# EAGLE design RapideUSB (EAGLE 6.3)
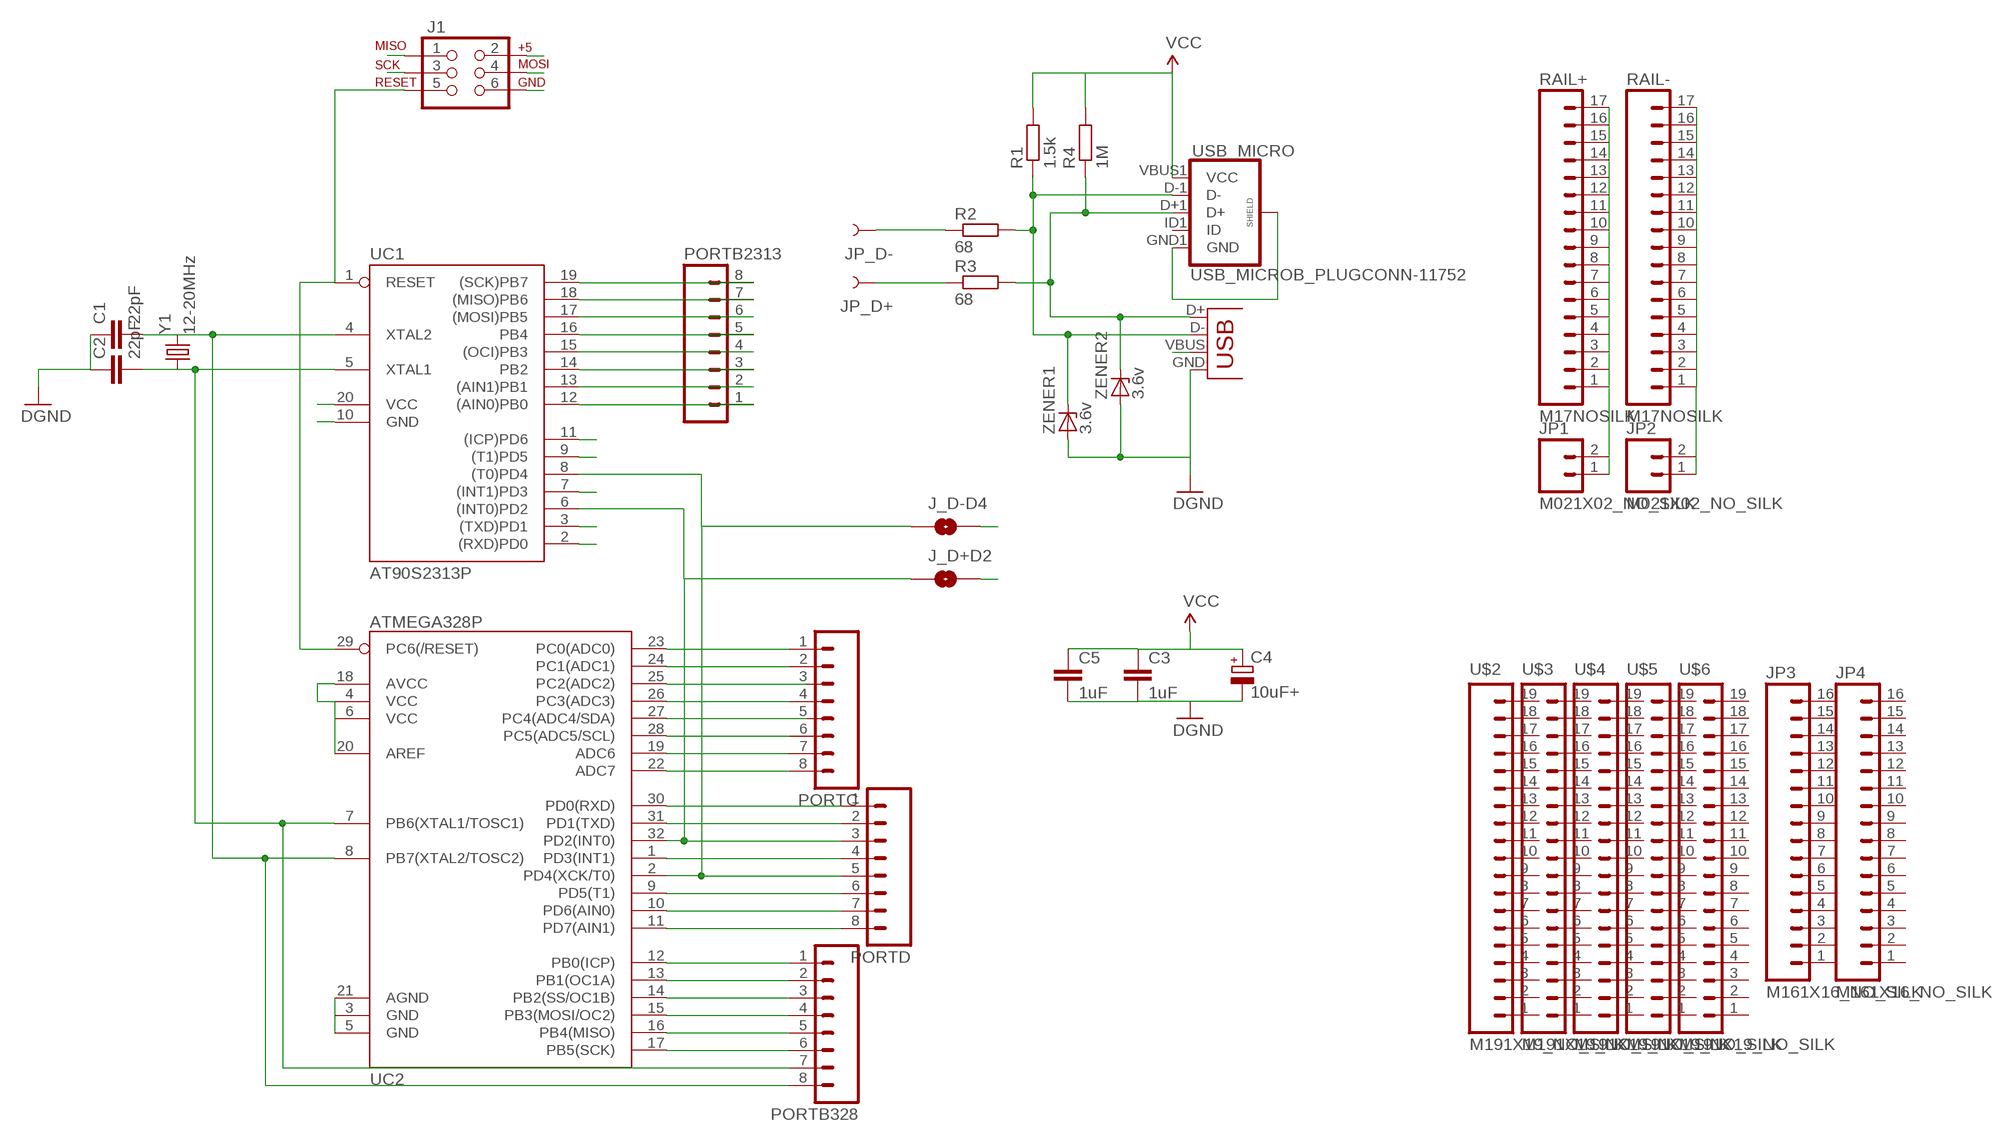
[diagram p0: schematic, sheet 1]

## Parts
C1  22pF  C-EU025-024X044  [C025-024X044]
C2  22pF  C-EU025-024X044  [C025-024X044]
C3  1uF  C-EU025-024X044  [C025-024X044]
C4  10uF+  CPOL-EUE2-5  [E2-5]
C5  1uF  C-EU025-024X044  [C025-024X044]
J1  AVR_SPI_PRG_6PTH  [2X3]
J_D+D2  JUMPER-PAD-2-NOYES_SILK  [PAD-JUMPER-2-NO_YES_SILK]
J_D-D4  JUMPER-PAD-2-NOYES_SILK  [PAD-JUMPER-2-NO_YES_SILK]
JP1  M021X02_NO_SILK  [1X02_NO_SILK]
JP2  M021X02_NO_SILK  [1X02_NO_SILK]
JP3  M161X16_NO_SILK  [1X16_NO_SILK]
JP4  M161X16_NO_SILK  [1X16_NO_SILK]
JP_D+  TEST-POINT3X5  [PAD.03X.05]
JP_D-  TEST-POINT3X5  [PAD.03X.05]
PORTB328  M081X08  [1X08]
PORTB2313  M081X08  [1X08]
PORTC  M081X08  [1X08]
PORTD  M081X08  [1X08]
R1  1.5k  R-EU_0204/2V  [0204V]
R2  68  R-EU_0204/2V  [0204V]
R3  68  R-EU_0204/2V  [0204V]
R4  1M  R-EU_0204/2V  [0204V]
RAIL+  M17NOSILK  [1X17_NO_SILK]
RAIL-  M17NOSILK  [1X17_NO_SILK]
U$2  M191X19_NO_SILK  [1X19_NO_SILK]
U$3  M191X19_NO_SILK  [1X19_NO_SILK]
U$4  M191X19_NO_SILK  [1X19_NO_SILK]
U$5  M191X19_NO_SILK  [1X19_NO_SILK]
U$6  M191X19_NO_SILK  [1X19_NO_SILK]
UC1  AT90S2313P  [DIL20]
UC2  ATMEGA328P  ATMEGA328_SMT  [TQFP32-08]
USB_MICRO  USB_MICROB_PLUGCONN-11752  [USB-B-MICRO-SMD_V03]
USB_MINI  USBSMD  [USB-MINIB]
Y1  12-20MHz  CRYSTALHC49UV  [HC49U-V]
ZENER1  3.6v  ZENER-DIODEZD-2.5  [ZDIO-2.5]
ZENER2  3.6v  ZENER-DIODEZD-2.5  [ZDIO-2.5]

## Nets
B0: PORTB328.1 UC2.12(PB0(ICP))
B1: PORTB328.2 UC2.13(PB1(OC1A))
B2: PORTB328.3 UC2.14(PB2(SS/OC1B))
B6: C2.2 PORTB328.7 UC1.5(XTAL1) UC2.7(PB6(XTAL1/TOSC1)) Y1.1
B7: C1.2 PORTB328.8 UC1.4(XTAL2) UC2.8(PB7(XTAL2/TOSC2)) Y1.2
D0: PORTD.1 UC1.2((RXD)PD0) UC2.30(PD0(RXD))
D1: PORTD.2 UC1.3((TXD)PD1) UC2.31(PD1(TXD))
D2: J_D+D2.1 PORTD.3 UC1.6((INT0)PD2) UC2.32(PD2(INT0))
D3: PORTD.4 UC1.7((INT1)PD3) UC2.1(PD3(INT1))
D4: J_D-D4.1 PORTD.5 UC1.8((T0)PD4) UC2.2(PD4(XCK/T0))
D5: UC1.9((T1)PD5)
D6: PORTD.7 UC1.11((ICP)PD6) UC2.10(PD6(AIN0))
D7: PORTD.8 UC2.11(PD7(AIN1))
D+: J_D+D2.2 JP_D+.P$1 R3.1
D-: J_D-D4.2 JP_D-.P$1 R2.1
GND: C1.1 C2.1 C3.2 C4.- C5.2 J1.6 JP2.1 JP2.2 RAIL-.1 RAIL-.2 RAIL-.3 RAIL-.4 RAIL-.5 RAIL-.6 RAIL-.7 RAIL-.8 RAIL-.9 RAIL-.10 RAIL-.11 RAIL-.12 RAIL-.13 RAIL-.14 RAIL-.15 RAIL-.16 RAIL-.17 UC1.10(GND) UC2.3(GND) UC2.5(GND) UC2.21(AGND) USB_MICRO.GND1(GND) USB_MICRO.SHIELD1(SHIELD) USB_MICRO.SHIELD2(SHIELD) USB_MICRO.SHIELD3(SHIELD) USB_MINI.GND ZENER1.A ZENER2.A ; supply symbol labelled DGND
MISO: J1.1 PORTB328.5 PORTB2313.7 UC1.18((MISO)PB6) UC2.16(PB4(MISO))
MOSI: J1.4 PORTB328.4 PORTB2313.6 UC1.17((MOSI)PB5) UC2.15(PB3(MOSI/OC2))
N$1: PORTB2313.5 UC1.16(PB4)
N$2: PORTB2313.4 UC1.15((OCI)PB3)
N$3: PORTB2313.3 UC1.14(PB2)
N$4: PORTB2313.2 UC1.13((AIN1)PB1)
N$5: PORTC.1 UC2.23(PC0(ADC0))
N$6: PORTC.2 UC2.24(PC1(ADC1))
N$7: UC2.25(PC2(ADC2))
N$8: PORTC.4 UC2.26(PC3(ADC3))
N$9: PORTC.5 UC2.27(PC4(ADC4/SDA))
N$10: PORTC.6 UC2.28(PC5(ADC5/SCL))
N$11: PORTC.7 UC2.19(ADC6)
N$12: PORTC.8 UC2.22(ADC7)
N$13: PORTB2313.1 UC1.12((AIN0)PB0)
N$16: PORTD.6 UC2.9(PD5(T1))
RESET: J1.5 UC1.1(RESET) UC2.29(PC6(/RESET))
SCK: J1.3 PORTB328.6 PORTB2313.8 UC1.19((SCK)PB7) UC2.17(PB5(SCK))
USBD+: R3.2 R4.1 USB_MICRO.D+1(D+) USB_MINI.D+ ZENER2.C
USBD-: R1.1 R2.2 USB_MICRO.D-1(D-) USB_MINI.D- ZENER1.C
VCC: C3.1 C4.+ C5.1 J1.2 JP1.1 JP1.2 R1.2 R4.2 RAIL+.1 RAIL+.2 RAIL+.3 RAIL+.4 RAIL+.5 RAIL+.6 RAIL+.7 RAIL+.8 RAIL+.9 RAIL+.10 RAIL+.11 RAIL+.12 RAIL+.13 RAIL+.14 RAIL+.15 RAIL+.16 RAIL+.17 UC1.20(VCC) UC2.4(VCC) UC2.6(VCC) UC2.18(AVCC) UC2.20(AREF) USB_MICRO.VBUS1(VCC) USB_MINI.VBUS
Unconnected: JP3.1 JP3.2 JP3.3 JP3.4 JP3.5 JP3.6 JP3.7 JP3.8 JP3.9 JP3.10 JP3.11 JP3.12 JP3.13 JP3.14 JP3.15 JP3.16 JP4.1 JP4.2 JP4.3 JP4.4 JP4.5 JP4.6 JP4.7 JP4.8 JP4.9 JP4.10 JP4.11 JP4.12 JP4.13 JP4.14 JP4.15 JP4.16 PORTC.3 U$2.1 U$2.2 U$2.3 U$2.4 U$2.5 U$2.6 U$2.7 U$2.8 U$2.9 U$2.10 U$2.11 U$2.12 U$2.13 U$2.14 U$2.15 U$2.16 U$2.17 U$2.18 U$2.19 U$3.1 U$3.2 U$3.3 U$3.4 U$3.5 U$3.6 U$3.7 U$3.8 U$3.9 U$3.10 U$3.11 U$3.12 U$3.13 U$3.14 U$3.15 U$3.16 U$3.17 U$3.18 U$3.19 U$4.1 U$4.2 U$4.3 U$4.4 U$4.5 U$4.6 U$4.7 U$4.8 U$4.9 U$4.10 U$4.11 U$4.12 U$4.13 U$4.14 U$4.15 U$4.16 U$4.17 U$4.18 U$4.19 U$5.1 U$5.2 U$5.3 U$5.4 U$5.5 U$5.6 U$5.7 U$5.8 U$5.9 U$5.10 U$5.11 U$5.12 U$5.13 U$5.14 U$5.15 U$5.16 U$5.17 U$5.18 U$5.19 U$6.1 U$6.2 U$6.3 U$6.4 U$6.5 U$6.6 U$6.7 U$6.8 U$6.9 U$6.10 U$6.11 U$6.12 U$6.13 U$6.14 U$6.15 U$6.16 U$6.17 U$6.18 U$6.19 USB_MICRO.ID1(ID)

## Library data of the parts
C1-C3 C5 = resistor:C-EU: CAPACITOR, European symbol
C4 = resistor:CPOL-EU: POLARIZED CAPACITOR, European symbol
J1 = SparkFun-Connectors:AVR_SPI_PRG_6: AVR ISP 6 Pin This is the reduced ISP connector for AVR programming. Common on Arduino. This footprint will take up less PCB space and can be used with a 10-pin to 6-pin adapter such as SKU: BOB-08508 **Special note about "TEST_POINT" package. The stop mask is on the top side, so if you want your programming test points to be on the bottom of your board, make sure to place this package on the bottom side of the board. This also ensure that the orientation to program from the bottom side will be correct.
J_D+D2 J_D-D4 = SparkFun-Passives:JUMPER-PAD-2-NO
JP1 JP2 = SparkFun-Connectors:M02: Standard 2-pin 0.1" header. Use with - straight break away headers ( PRT-00116) - right angle break away headers (PRT-00553) - swiss pins (PRT-00743) - machine pins (PRT-00117) - female headers (PRT-00115) Molex polarized connector foot print use with: PRT-08233 with associated crimp pins and housings. 2.54_SCREWTERM for use with PRT-10571. 3.5mm Screw Terminal footprints for PRT-08084 5mm Screw Terminal footprints for use with PRT-08433
JP3 JP4 = SparkFun-Connectors:M16: 1x16 .1" header
JP_D+ JP_D- = SparkFun-Passives:TEST-POINT: Bare copper test points for troubleshooting or ICT
PORTB328 PORTB2313 PORTC PORTD = SparkFun-Connectors:M08: Header 8 Standard 8-pin 0.1" header. Use with straight break away headers (SKU : PRT-00116), right angle break away headers (PRT-00553), swiss pins (PRT-00743), machine pins (PRT-00117), and female headers (PRT-00115).
R1-R4 = resistor:R-EU_: RESISTOR, European symbol
RAIL+ RAIL- = SparkFun-Connectors:M17: 1x17 .1" header
U$2-U$6 = SparkFun-Connectors:M19: 1x19 .1" header
UC1 = atmel:AT90S2313: MICROCONTROLLER 2 Kbytes FLASH 128 bytes SRAM 128 bytes EEPROM UART; OC_FARNELL: unknown; OC_NEWARK: unknown
UC2 = SparkFun-DigitalIC:ATMEGA328_SMT: 32-Pin Atmega328 part Commonly used on Arduino compatible boards Available in QFP and QFN packages TQFP is IC-09069 QFN is non-stock; PROD_ID: IC-09069
USB_MICRO = SparkFun-Connectors:USB_MICROB_PLUG: USB Micro-B connectors Some male, some female. Watch your step!; PROD_ID: CONN-11752
USB_MINI = SparkFun-Connectors:USB: USB Connectors USB-B-PTH is fully proven SKU : PRT-00139/CONN-08278 USB-miniB is fully proven SKU : PRT-00587 USB-A-PCB is untested. USB-A-H is throughly reviewed, but untested. Spark Fun Electronics SKU : PRT-00437 USB-B-SMT is throughly reviewed, but untested. Needs silkscreen touching up. USB-A-S has not been used/tested USB-MB-H has not been used/tested USB-MICROB has been used. CONN-09505; PROD_ID: CONN-08193
Y1 = SparkFun-FreqCtrl:CRYSTAL: Various standard crystals. Proven footprints.
ZENER1 ZENER2 = diode:ZENER-DIODE: Z-Diode

## Board
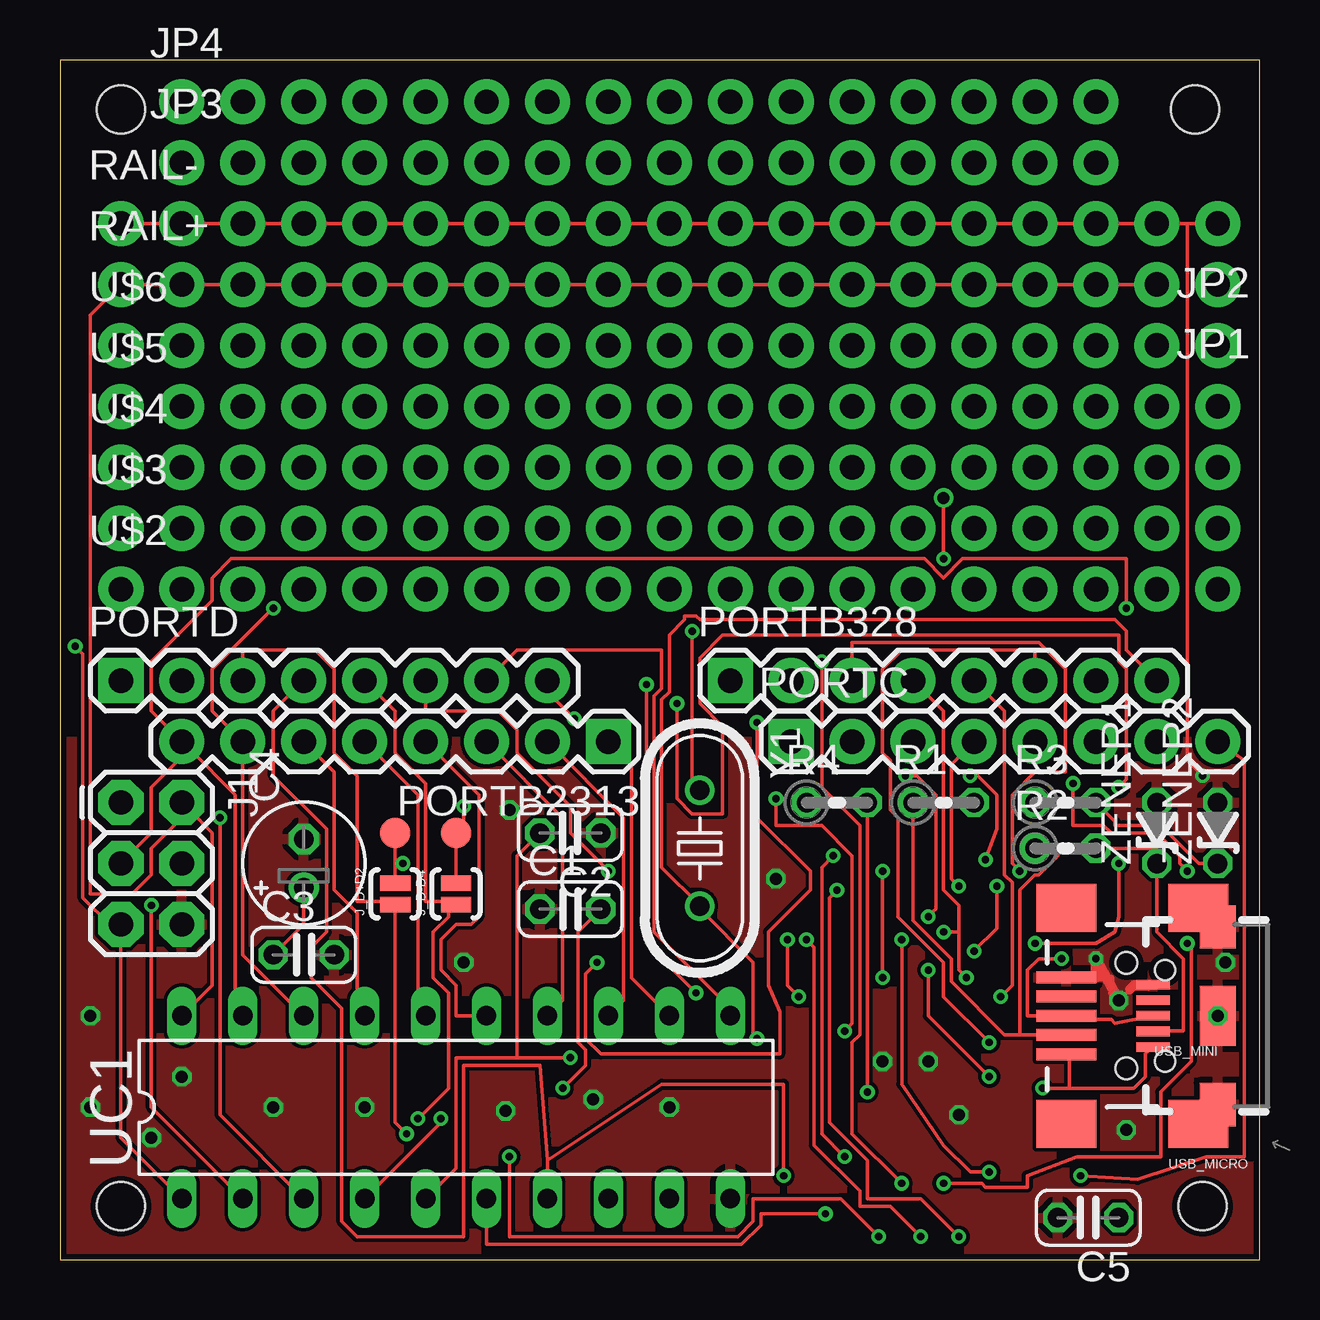
[diagram p1: board, top side]
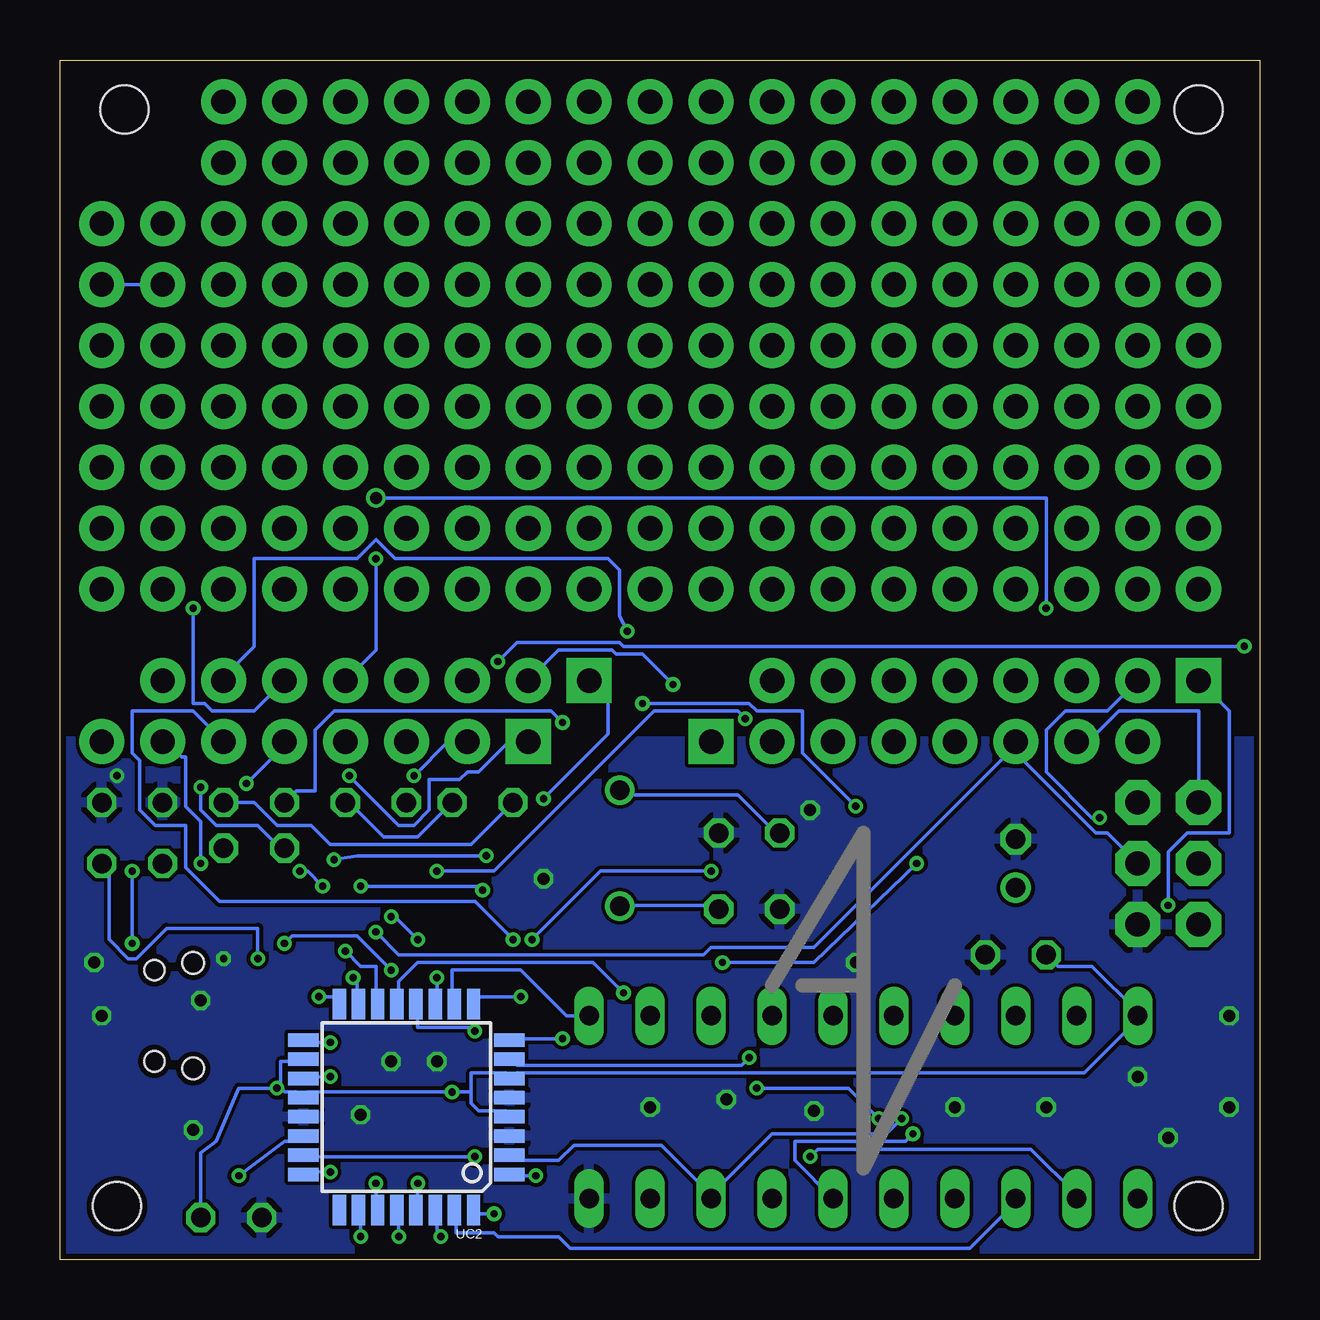
[diagram p2: board, bottom side, seen from below]

Size 50 x 50 mm. Coordinates in mm from the lower left corner, seen from the top.
Outline: 0,0 50,0 50,50 0,50 0,0
Copper layers (1*2*15*16): Top 0.035mm / dielectric 0.2mm / layer 2 0.0175mm / dielectric 1.1mm / layer 15 0.0175mm / dielectric 0.2mm / Bottom 0.035mm
Design rules "SeeedStudio_DRU_no_angle_20130527": minimum track width 6mil, minimum drill 12mil, track to track 6mil, track to pad 6mil, pad to pad 6mil, via to via 6mil, smd to smd 0mil, copper to edge 10mil, drill to drill 10mil, minimum pad ring 6mil, minimum via ring 6mil, stop-mask expansion 2mil, vias tented up to drill 25mil, thermal gap 10mil
Holes 2 mm at 47.62,2.22 2.54,47.94 47.31,47.94 2.54,2.22

### Footprints (pad centres in the part's own frame; a part is rotated, then mirrored left to right if it is on the bottom)
C025-024X044 = drill 0.813 octagon: 1 -1.27,0; 2 1.27,0
E2-5 = drill 0.813 pad 1.27: + -1.016,0 | drill 0.813 pad 1.27 octagon: - 1.016,0
2X3 = drill 1.016 pad 1.88 octagon: 1 0,0; 2 0,2.54; 3 2.54,0; 4 2.54,2.54; 5 5.08,0; 6 5.08,2.54
PAD-JUMPER-2-NO_YES_SILK = smd 0.635 x 1.27: 1 -0.45,0; 2 0.45,0
1X02_NO_SILK = drill 1.016 pad 1.88: 1 0,0; 2 2.54,0
1X16_NO_SILK = drill 1.016 pad 1.88: 1 0,0; 2 2.54,0; 3 5.08,0; 4 7.62,0; 5 10.16,0; 6 12.7,0; 7 15.24,0; 8 17.78,0; 9 20.32,0; 10 22.86,0; 11 25.4,0; 12 27.94,0; 13 30.48,0; 14 33.02,0; 15 35.56,0; 16 38.1,0
PAD.03X.05 = smd 1.27 x 1.27: P$1 0,0
1X08 = drill 1.016 pad 1.88 square: 1 0,0 | drill 1.016 pad 1.88: 2 2.54,0; 3 5.08,0; 4 7.62,0; 5 10.16,0; 6 12.7,0; 7 15.24,0; 8 17.78,0
0204V = drill 0.813 octagon: 1 -1.27,0; 2 1.27,0
1X17_NO_SILK = drill 1.016 pad 1.88: 1 0,0; 2 2.54,0; 3 5.08,0; 4 7.62,0; 5 10.16,0; 6 12.7,0; 7 15.24,0; 8 17.78,0; 9 20.32,0; 10 22.86,0; 11 25.4,0; 12 27.94,0; 13 30.48,0; 14 33.02,0; 15 35.56,0; 16 38.1,0; 17 40.64,0
1X19_NO_SILK = drill 1.016 pad 1.88: 1 0,0; 2 2.54,0; 3 5.08,0; 4 7.62,0; 5 10.16,0; 6 12.7,0; 7 15.24,0; 8 17.78,0; 9 20.32,0; 10 22.86,0; 11 25.4,0; 12 27.94,0; 13 30.48,0; 14 33.02,0; 15 35.56,0; 16 38.1,0; 17 40.64,0; 18 43.18,0; 19 45.72,0
DIL20 = drill 0.813 long: 1 -11.43,-3.81; 2 -8.89,-3.81; 3 -6.35,-3.81; 4 -3.81,-3.81; 5 -1.27,-3.81; 6 1.27,-3.81; 7 3.81,-3.81; 8 6.35,-3.81; 9 8.89,-3.81; 10 11.43,-3.81; 11 11.43,3.81; 12 8.89,3.81; 13 6.35,3.81; 14 3.81,3.81; 15 1.27,3.81; 16 -1.27,3.81; 17 -3.81,3.81; 18 -6.35,3.81; 19 -8.89,3.81; 20 -11.43,3.81
TQFP32-08 = smd 1.27 x 0.559: 1 -4.293,2.8; 2 -4.293,2; 3 -4.293,1.2; 4 -4.293,0.4; 5 -4.293,-0.4; 6 -4.293,-1.2; 7 -4.293,-2; 8 -4.293,-2.8; 17 4.293,-2.8; 18 4.293,-2; 19 4.293,-1.2; 20 4.293,-0.4; 21 4.293,0.4; 22 4.293,1.2; 23 4.293,2; 24 4.293,2.8 | smd 0.559 x 1.27: 9 -2.8,-4.293; 10 -2,-4.293; 11 -1.2,-4.293; 12 -0.4,-4.293; 13 0.4,-4.293; 14 1.2,-4.293; 15 2,-4.293; 16 2.8,-4.293; 25 2.8,4.293; 26 2,4.293; 27 1.2,4.293; 28 0.4,4.293; 29 -0.4,4.293; 30 -1.2,4.293; 31 -2,4.293; 32 -2.8,4.293
USB-B-MICRO-SMD_V03 = smd 1.4 x 0.4: D+1 2.7,0; D-1 2.7,0.65; GND1 2.7,-1.3; ID1 2.7,-0.65; VBUS1 2.7,1.3 | smd 1.5 x 1.8: SHIELD1 0,3.7; SHIELD2 0,-3.7 | smd 1.5 x 2.5: SHIELD3 0,0 | hole 0.85: 2.2,1.9; 2.2,-1.9
USB-MINIB = smd 2.5 x 0.5: D+ 2.5,0; D- 2.5,0.8; GND 2.5,-1.6; ID 2.5,-0.8; VBUS 2.5,1.6 | smd 2.5 x 2: MTN1 -3,4.5; MTN2 2.5,4.5; MTN3 -3,-4.5; MTN4 2.5,-4.5 | hole 0.9: 0,2.2; 0,-2.2
HC49U-V = drill 0.813: 1 -2.413,0; 2 2.413,0
ZDIO-2.5 = drill 0.813 octagon: A 1.27,0; C -1.27,0

### Placement (x,y rotation side)
C1  21.27,14.61 0 top
C2  21.27,17.78 180 top
C3  10.16,12.7 0 top
C4  10.16,16.51 90 top
C5  42.86,1.75 180 top
J1  2.54,19.05 270 top
J_D+D2  13.97,15.24 90 top
J_D-D4  16.51,15.24 90 top
JP1  48.26,40.64 180 top
JP2  48.26,43.18 180 top
JP3  5.08,45.72 0 top
JP4  5.08,48.26 0 top
JP_D+  13.97,17.78 0 top
JP_D-  16.51,17.78 0 top
PORTB328  27.94,24.13 0 top
PORTB2313  22.86,21.59 180 top
PORTC  30.48,21.59 0 top
PORTD  2.54,24.13 0 top
R1  36.83,19.05 0 top
R2  41.91,17.14 0 top
R3  41.91,19.05 0 top
R4  32.38,19.05 0 top
RAIL+  2.54,40.64 0 top
RAIL-  2.54,43.18 0 top
U$1  [VUSB_LOGO]  32.38,12.38 0 top
U$2  2.54,27.94 0 top
U$3  2.54,30.48 0 top
U$4  2.54,33.02 0 top
U$5  2.54,35.56 0 top
U$6  2.54,38.1 0 top
UC1  16.51,6.35 0 top
UC2  35.56,6.35 180 bottom
USB_MICRO  48.26,10.16 180 top
USB_MINI  44.45,10.16 180 top
Y1  26.67,17.14 270 top
ZENER1  45.72,17.78 90 top
ZENER2  48.26,17.78 90 top

### Tracks (layer width: path | path; a pad name or v marks a point on that pad's centre or on a via)
B0  (via drill 0.3)
  Top 0.152: v32.7,9.53 33.02,9.84 33.02,16.83 31.75,18.1 29.84,18.1 v29.84,19.21
  Bottom 0.152: v32.7,9.53 32.86,9.68 35.08,9.68 35.08,10.64 UC2.12 | v29.84,19.21 27.15,21.91 27.15,24.13 PORTB328.1
B1  (via drill 0.3)
  Top 0.152: v26.51,11.11 24.45,13.18 v24.45,23.97
  Bottom 0.152: v26.51,11.11 27.78,12.38 35.08,12.38 35.88,11.59 35.88,10.79 UC2.13 | v24.45,23.97 25.72,25.24 26.83,25.24 26.99,25.4 29.21,25.4 PORTB328.2
B2  (via drill 0.3)
  Top 0.152: v38.1,12.86 39.05,13.81 v39.05,15.56 | v40.01,16.19 39.69,16.51 39.69,19.37 40.64,20.32 41.91,20.32 41.91,24.61 40.8,25.72 33.02,25.72 PORTB328.3
  Bottom 0.152: v38.1,12.86 37.47,12.22 36.83,12.22 36.83,10.79 UC2.14 | v39.05,15.56 39.69,16.19 v40.01,16.19
B6  (via drill 0.3)
  Top 0.152: 19.05,8.41 16.51,8.41 16.51,3.81 UC1.5 | 19.05,8.41 v21.27,8.41 | C2.2 19.05,16.83 19.05,8.41 | v26.35,26.19 26.35,20 26.67,19.68 Y1.1
  Bottom 0.152: v21.27,8.41 21.59,8.1 30.96,8.1 31.11,8.26 UC2.7 | C2.2 20.16,17.78 21.75,19.37 26.51,19.37 26.67,19.53 Y1.1 | PORTB328.7 43.18,24.29 41.91,25.56 41.91,29.21 37.62,29.21 36.83,30 36.04,29.21 27.15,29.21 26.67,28.73 26.67,26.83 v26.35,26.19
B7  (via drill 0.3)
  Top 0.152: UC1.4 15.88,5.71 v15.88,5.87 | v20.95,7.14 21.91,8.1 21.91,8.73 21.59,9.05 21.59,13.65 C1.2 | v29.05,9.21 28.89,9.37 28.89,12.38 26.67,14.61 Y1.2 26.67,14.76 25.08,16.35 25.08,23.34 25.4,23.65 25.4,26.04 26.04,26.67 26.04,26.83 26.51,26.83 26.67,26.67 43.97,26.67 44.45,26.19 44.45,25.4 PORTB328.8
  Bottom 0.152: v15.88,5.87 17.14,7.14 v20.95,7.14 | v29.05,9.21 31.11,9.21 UC2.8 | C1.2 22.7,14.76 26.67,14.76 Y1.2
D0  (via drill 0.3)
  Top 0.152: v34.13,0.95 32.54,2.54 28.89,2.54 28.89,1.59 28.26,0.95 18.73,0.95 v18.73,4.29 | v3.81,14.76 3.81,6.35 UC1.2
  Bottom 0.152: v34.13,0.95 34.29,0.95 34.29,1.91 UC2.30 | v18.73,4.29 18.41,4.6 9.53,4.6 7.62,2.7 UC1.2 | PORTD.1 1.27,22.86 1.27,17.78 3.02,17.78 3.81,16.99 v3.81,14.76
D1  (via drill 0.3)
  Top 0.152: v6.67,18.41 6.67,6.03 UC1.3
  Bottom 0.152: UC1.3 10.16,2.38 12.06,0.48 28.73,0.48 29.21,0.95 31.75,0.95 31.91,1.11 33.5,1.11 33.5,1.91 UC2.31 | PORTD.2 6.35,22.86 8.1,22.86 8.89,22.07 8.89,20.32 6.99,18.41 v6.67,18.41
D2  (via drill 0.3)
  Top 0.152: v31.91,1.91 29.21,1.91 29.21,1.43 28.42,0.64 17.78,0.64 UC1.6 | PORTD.3 7.62,25.4 10.64,25.4 11.43,24.61 11.43,21.11 12.38,20.16 12.38,14.92 13.97,14.92 J_D+D2.1 13.97,5.71 v14.45,5.24
  Bottom 0.152: v31.91,1.91 32.7,1.91 UC2.32 | UC1.6 19.37,4.13 19.37,4.92 14.76,4.92 v14.45,5.24
D3  (via drill 0.3)
  Top 0.152: v30.16,3.49 30.16,7.3 25.08,7.3 20.32,4.13 | UC1.7 20.32,4.13 | PORTD.4 8.89,22.86 8.89,20.16 11.11,17.94 11.11,13.65 10.48,13.02 10.48,11.75 11.75,10.48 11.75,1.59 12.38,0.95 16.83,0.95 16.83,8.1 20,8.1 20.32,4.13
  Bottom 0.152: v30.16,3.49 31.11,3.49 UC2.1
D4  (via drill 0.3)
  Top 0.152: 16.19,14.92 15.24,14.92 15.24,19.84 13.97,21.11 13.97,22.86 PORTD.5 | 16.19,14.92 16.51,14.92 J_D-D4.1 16.19,14.92 | v14.92,5.87 16.19,7.14 16.19,11.11 15.56,11.75 15.56,13.65 16.19,14.29 16.19,14.92
  Bottom 0.152: 22.86,2.7 24.92,4.76 28.57,4.76 29.21,4.13 30.96,4.13 31.11,4.29 UC2.2 | 22.86,2.7 20.32,5.24 15.56,5.24 v14.92,5.87 | 22.86,2.7 UC1.8
D6
  Top 0.152: PORTD.7 19.05,25.4 25.08,25.4 25.08,23.81 24.77,23.5 24.77,13.65 27.94,10.48 UC1.11
  Bottom 0.152: UC1.11 28.89,10.16 30.8,12.06 33.66,12.06 33.66,10.79 UC2.10
D7  (via drill 0.3)
  Top 0.152: v34.29,16.19 v34.29,11.75 | v21.43,22.54 20.32,23.65 PORTD.8
  Bottom 0.152: v34.29,11.75 34.29,10.79 UC2.11 | v34.29,16.19 31.91,16.19 25.24,22.86 21.75,22.86 v21.43,22.54
D+  (via drill 0.3)
  Top 0.152: JP_D+.P$1 13.97,16.51 | 13.97,16.51 J_D+D2.2 | v14.29,16.51 13.97,16.51 | v22.38,12.38 21.91,11.91 21.91,9.21 22.54,8.57 30,8.57 30,10.32 29.53,11.43 29.53,13.65 31.27,15.4 31.27,16.19 29.05,18.41 v29.05,22.38
  Bottom 0.152: v14.29,16.51 18.57,12.38 v22.38,12.38 | v29.05,22.38 29.53,22.86 38.58,22.86 39.37,22.07 39.37,19.53 40.16,19.53 R3.1
D-  (via drill 0.3)
  Top 0.152: J_D-D4.2 JP_D-.P$1 16.83,18.1 v16.83,18.89 | v25.72,23.18 25.72,19.21 26.35,18.57 27.62,18.57 27.62,22.23 26.67,23.18 26.67,25.08 27.62,26.04 44.13,26.04 44.13,24.92 44.45,24.61 44.45,20 v44.13,19.68
  Bottom 0.152: v16.83,18.89 19.05,21.11 19.05,22.86 20.95,22.86 21.27,23.18 v25.72,23.18 | v44.13,19.68 44.13,18.73 43.5,18.1 41.75,18.1 40.8,17.14 R2.1
GND  (via drill 0.3, 0.5)
  Top 0.152: 44.61,11.27 44.61,11.11 44.43,11.08 | 45.4,11.43 USB_MICRO.GND1 | v47.62,20.16 46.99,20.8 46.99,43.18 | 46.99,43.18 JP2.2 RAIL-.17 RAIL-.16 RAIL-.15 RAIL-.14 RAIL-.13 RAIL-.12 RAIL-.11 RAIL-.10 RAIL-.9 RAIL-.8 RAIL-.7 RAIL-.6 RAIL-.5 RAIL-.4 RAIL-.3 RAIL-.2 RAIL-.1 | 46.99,43.18 JP2.1
  Top 0.254: 41.91,11.75 42.23,11.75 | 43.18,11.75 43.81,11.75 43.81,11.11 v44.13,10.79
  Top 0.406: 45.4,11.43 44.77,11.43 44.61,11.27 | 42.23,11.75 43.18,11.75 v43.18,12.54 v44.13,10.79
  other vias: 48.26,10.16 16.83,12.38 18.73,18.73 25.4,6.35 34.29,8.26 37.47,6.03 1.27,6.35 5.08,7.62 12.7,6.35 1.27,10.16 29.84,15.88 36.2,8.26 44.45,5.4 48.58,12.38 8.89,6.35 18.57,6.19 3.81,5.08 22.23,6.67
  pour Bottom: 0,21.59 50.8,21.59 50.8,-1.27 -1.27,-1.27 -1.27,21.59
  pour Top: -5.08,21.59 54.61,21.59 54.61,-5.08 -5.08,-5.08
MISO  (via drill 0.3, 0.5)
  Top 0.152: v39.21,10.95 39.69,11.43 39.69,15.72 39.37,16.03 39.37,22.86 PORTB328.5 | UC1.18 7.62,12.7 PORTB2313.7 6.35,22.86 6.35,24.61 v8.89,27.15 | v36.83,29.21 v36.83,31.75
  Bottom 0.152: v39.21,10.95 38.58,10.95 38.42,10.79 UC2.16 | J1.1 2.54,22.86 5.87,22.86 7.14,21.59 PORTB2313.7 | v36.83,31.75 8.89,31.75 v8.89,27.15 | PORTB328.5 36.83,25.4 v36.83,29.21
MOSI  (via drill 0.3)
  Top 0.152: v37.78,11.75 37.47,12.06 37.47,13.65 | 37.47,13.65 37.47,14.76 36.83,15.4 36.83,22.86 PORTB328.4 | UC1.17 12.38,10.48 12.38,14.45 11.43,15.4 11.43,20.32 PORTB2313.6 | v36.83,13.65 37.47,13.65
  Bottom 0.152: v37.78,11.75 37.62,11.75 37.62,10.79 UC2.15 | J1.4 6.35,17.78 6.83,17.78 10.16,21.11 | v36.83,13.65 35.88,12.7 23.18,12.7 22.86,13.02 18.57,13.02 10.48,21.11 10.16,21.11 | 10.16,21.11 PORTB2313.6
N$1
  Top 0.152: UC1.16 14.92,10.48 14.92,19.37 PORTB2313.5
N$2
  Top 0.152: UC1.15 16.51,10.16 16.51,11.43 15.88,12.06 15.88,13.34 16.51,13.97 17.14,13.97 17.46,14.29 17.46,19.37 PORTB2313.4
N$3
  Top 0.152: UC1.14 20.95,10.79 20.95,18.41 PORTB2313.3
N$4
  Top 0.152: UC1.13 23.5,10.79 23.5,18.41 PORTB2313.2
N$5  (via drill 0.3)
  Top 0.152: v32.7,4.29 31.75,5.24 31.75,16.35 v32.23,16.83 | v38.58,16.67 39.05,17.94 39.05,19.37 38.26,20.16 v37.94,20.16
  Bottom 0.152: v32.7,4.29 39.85,4.29 UC2.23 | v32.23,16.83 37.62,16.83 v38.58,16.67 | v37.94,20.16 35.88,18.1 35.24,18.1 34.61,18.73 34.61,20 33.34,20 33.02,20.32 32.54,20.32 31.27,21.59 PORTC.1
N$6  (via drill 0.3)
  Top 0.152: v38.73,3.65 37.94,3.65 36.83,4.76 35.08,7.3 v35.08,13.34 | v36.2,14.29 36.51,14.61 36.51,19.37 35.72,20.16 v35.24,20.16
  Bottom 0.152: v38.73,3.65 39.85,3.65 UC2.24 | v35.08,13.34 36.04,14.29 v36.2,14.29 | v35.24,20.16 33.81,21.59 PORTC.2
N$8  (via drill 0.3)
  Top 0.152: v37.47,0.95 35.88,2.54 33.66,2.54 33.66,4.13 32.07,5.71 32.07,15.08 v32.38,15.4 | v37.47,15.56 37.15,15.88 37.15,20.64 PORTC.4
  Bottom 0.152: v37.47,0.95 37.47,1.91 UC2.26 | v32.38,15.4 32.54,15.56 v37.47,15.56
N$9  (via drill 0.3)
  Top 0.152: v36.83,3.17 38.42,3.17 38.58,3.02 40.32,3.02 40.32,3.49 42.39,4.29 45.88,4.29 45.88,6.99 47.15,8.26 47.15,13.02 v46.99,13.18 | v46.99,16.19 46.67,16.51 46.67,16.83 45.72,17.78 43.81,17.78 43.5,18.1 42.23,18.1 v42.23,19.84
  Bottom 0.152: v36.83,3.17 36.83,2.06 UC2.27 | v46.99,16.19 v46.99,13.18 | v42.23,19.84 40.64,21.43 PORTC.5
N$10  (via drill 0.3)
  Top 0.152: v35.88,0.95 34.61,2.22 33.34,2.22 33.34,2.86 31.43,4.76 31.43,13.02 v31.11,13.34
  Bottom 0.152: v35.88,0.95 35.88,1.91 UC2.28 | v31.11,13.34 32.7,14.92 43.34,14.92 44.77,16.35 44.77,18.1 46.04,18.1 46.67,18.73 46.67,20.8 46.99,21.11 46.99,22.86 44.45,22.86 PORTC.6
N$11  (via drill 0.3)
  Top 0.152: v38.73,7.62 36.2,10.16 v36.2,12.06 | v40.64,13.18 43.18,13.18 43.97,13.65 44.13,14.29 v44.13,16.51
  Bottom 0.152: v38.73,7.62 39.85,7.62 UC2.19 | v36.2,12.06 37.62,13.49 40.32,13.49 v40.64,13.18 | v44.13,16.51 44.13,18.26 44.77,18.89 44.77,20.95 44.93,20.95 45.56,21.59 PORTC.7
N$12  (via drill 0.3)
  Top 0.152: v42.55,3.49 44.93,3.33 47.78,4.29 49.37,4.29 49.37,20.8 PORTC.8
  Bottom 0.152: v42.55,3.49 40.64,4.92 40.16,4.92 40.01,5.08 UC2.22
N$13
  Top 0.152: UC1.12 23.81,11.75 23.81,20.64 PORTB2313.1
N$16  (via drill 0.3)
  Top 0.152: v30.8,10.95 30.32,11.43 v30.32,13.34 | v22.86,16.19 21.27,17.78 21.27,18.89 19.05,21.11 19.05,22.07 18.26,22.86 15.24,22.86 PORTD.6
  Bottom 0.152: v30.8,10.95 32.54,10.95 32.7,10.79 UC2.9 | v30.32,13.34 27.46,16.19 v22.86,16.19
RESET  (via drill 0.3)
  Top 0.152: v35.08,3.17 33.02,5.24 33.02,9.05 33.34,9.37 33.34,18.1 31.75,19.68 v31.75,24.92 | v0.64,25.56 0.95,25.24 0.95,15.08 2.06,13.97 J1.5 2.54,5.08 UC1.1
  Bottom 0.152: v35.08,3.17 35.08,2.06 UC2.29 | v31.75,24.92 30.96,25.72 26.67,25.72 26.51,25.56 v0.64,25.56
SCK  (via drill 0.3)
  Top 0.152: UC1.19 7.3,10.48 7.3,19.37 5.4,21.27 | J1.3 3.81,17.78 3.81,19.68 5.4,21.27 | 5.4,21.27 PORTB2313.8 3.81,22.86 3.81,24.92 6.35,27.46 6.35,28.42 7.14,29.21 36.04,29.21 36.83,28.42 37.62,29.21 44.45,29.21 v44.45,27.15 | v38.73,9.05 36.83,10.95 36.83,12.38 34.92,14.29 34.92,18.41 34.61,18.73 34.61,20.8 34.29,21.11 34.29,24.61 35.08,25.4 40.64,25.4 PORTB328.6
  Bottom 0.152: v38.73,9.05 39.85,9.05 UC2.17 | v44.45,27.15 44.45,23.18 43.97,23.18 43.66,22.86 41.91,22.86 PORTB328.6
USBD+  (via drill 0.3)
  Top 0.152: USB_MICRO.D+1 43.97,9.84 43.81,10 42.07,10 42.07,10.16 USB_MINI.D+ 40.32,10.16 40.32,12.06 40.8,12.54 v41.75,12.54 | ZENER2.C 47.47,16.51 45.88,18.1 43.97,18.1 43.97,18.26 R3.2
  Bottom 0.152: R4.1 32.86,17.3 38.73,17.3 39.53,18.1 40.96,18.1 41.91,19.05 R3.2 | v41.75,12.54 41.75,13.81 45.56,13.81 46.83,12.54 47.15,12.54 47.94,13.34 47.94,16.51 ZENER2.C
USBD-
  Top 0.152: USB_MICRO.D-1 45.56,9.53 46.83,9.53 46.83,12.54 45.72,13.65 ZENER1.C 45.72,17.14 R2.2 41.59,17.14 41.59,16.83 40.8,16.03 40.64,16.03 40.01,15.4 40.01,9.37 | R1.1 35.56,14.13 37.15,12.54 37.15,11.59 39.37,9.37 40.01,9.37 | 40.01,9.37 41.91,9.37 USB_MINI.D-
VCC  (via drill 0.3)
  Top 0.152: 42.07,7.14 44.77,7.14 45.24,7.62 45.24,8.57 45.4,8.73 USB_MICRO.VBUS1 | 42.07,7.14 42.07,8.41 USB_MINI.VBUS | v40.96,7.14 42.07,7.14 | v33.66,6.99 R4.2 | C3.1 10.16,13.97 C4.+ | UC1.20 6.35,11.43 6.35,17.78 5.4,18.73 | JP1.2 RAIL+.17 RAIL+.16 RAIL+.15 RAIL+.14 RAIL+.13 RAIL+.12 RAIL+.11 RAIL+.10 RAIL+.9 RAIL+.8 RAIL+.7 RAIL+.6 RAIL+.5 RAIL+.4 RAIL+.3 RAIL+.2 RAIL+.1 1.27,39.37 1.27,15.24 3.02,15.24 3.81,16.03 3.81,17.14 5.4,18.73 | 5.4,18.73 J1.2
  Bottom 0.152: R4.2 35.08,17.62 36.51,17.62 37.94,19.05 R1.2 | 40.8,7.14 40.64,6.99 40.16,6.99 40.01,6.83 UC2.20 39.85,6.83 39.69,6.99 v33.66,6.99 32.86,6.99 | 40.8,7.14 40.8,8.26 40.01,8.26 UC2.18 | 32.86,6.99 32.86,7.78 31.43,7.78 31.27,7.62 UC2.6 31.11,7.62 30.96,7.78 7.3,7.78 5.08,10 UC1.20 5.08,10.32 6.99,12.22 8.41,12.22 C3.1 | 32.86,6.99 32.86,6.51 32.54,6.19 31.43,6.19 31.27,6.03 UC2.4 | 40.8,7.14 v40.96,7.14 42.55,7.14 43.5,4.92 44.13,4.45 C5.1 | JP1.2 JP1.1

### Text on the board
bDocu: http://kalshagar.wikispaces.com/RapideUSB | ATmega / 328
Notes: GND | VCC | Cut ok | Cut ok | D0 | RapideUSB | B328 | C0 | B2313 | D+ | D- | R3 | (R4) | R1 | 1.5k | R2 | (C3) | D-=D4 | D+=D2 | USB | ATtiny2313 | RapideUSB v1.1 Jan2015 | (C5)